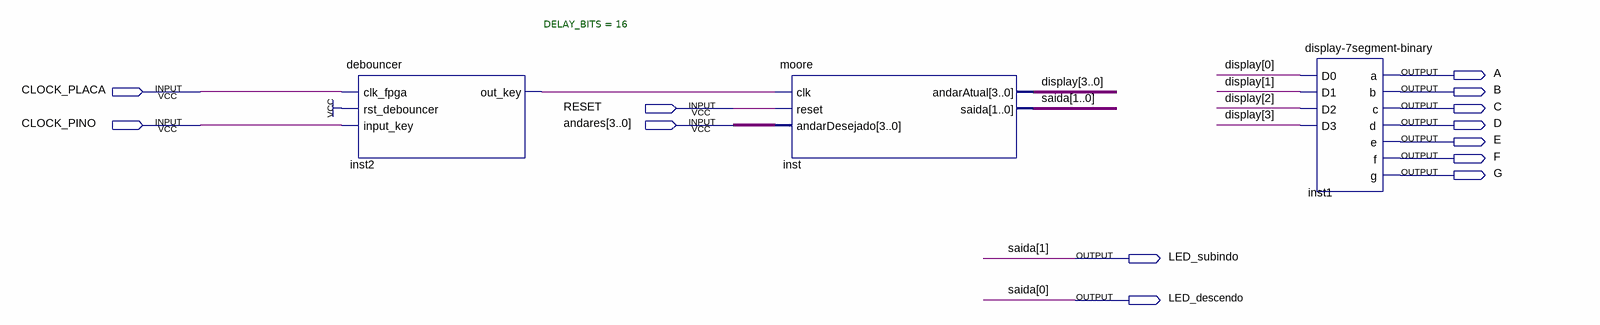
[diagram p0: schematic sheet]
// Quartus schematic elevador.bdf as structural Verilog: 3 symbols, 13 pins
module elevador (
  input  CLOCK_PLACA,
  input  RESET,
  input  CLOCK_PINO,
  input  [3:0] andares,
  output A,
  output B,
  output C,
  output D,
  output E,
  output F,
  output G,
  output LED_subindo,
  output LED_descendo
);

  wire inst2_out_key;
  wire [3:0] display;

  debouncer #(.DELAY_BITS(16)) inst2 (
    .clk_fpga(CLOCK_PLACA), .rst_debouncer(1'b1), .input_key(CLOCK_PINO), .out_key(inst2_out_key));
  moore inst (
    .clk(inst2_out_key), .reset(RESET), .andarDesejado(andares), .andarAtual(display),
    .saida({LED_subindo, LED_descendo}));
  \display-7segment-binary  inst1 (
    .D0(display[0]), .D1(display[1]), .D2(display[2]), .D3(display[3]), .a(A), .b(B), .c(C), .d(D), .e(E),
    .f(F), .g(G));

  // Other names for the same wires on the sheet: saida[1:0] = {LED_subindo, LED_descendo}
endmodule
